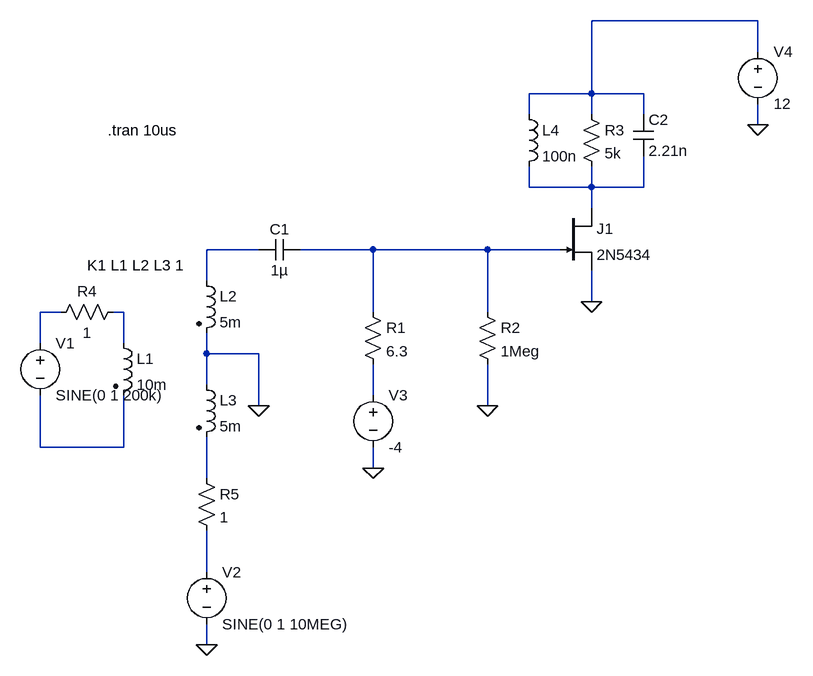
[diagram p0: schematic AMModulator.asc]
AMModulator.asc, the LTspice schematic file:
Version 4
SHEET 1 1160 680
WIRE 1104 -384 848 -384
WIRE 1104 -336 1104 -384
WIRE 848 -272 848 -384
WIRE 848 -272 752 -272
WIRE 928 -272 848 -272
WIRE 752 -240 752 -272
WIRE 848 -240 848 -272
WIRE 928 -240 928 -272
WIRE 1104 -224 1104 -256
WIRE 752 -128 752 -160
WIRE 848 -128 848 -160
WIRE 848 -128 752 -128
WIRE 928 -128 928 -176
WIRE 928 -128 848 -128
WIRE 848 -96 848 -128
WIRE 336 -32 256 -32
WIRE 512 -32 400 -32
WIRE 688 -32 512 -32
WIRE 800 -32 688 -32
WIRE 256 16 256 -32
WIRE 848 48 848 0
WIRE 32 64 0 64
WIRE 128 64 112 64
WIRE 512 64 512 -32
WIRE 688 64 688 -32
WIRE 0 112 0 64
WIRE 128 112 128 64
WIRE 256 128 256 96
WIRE 336 128 256 128
WIRE 256 176 256 128
WIRE 512 192 512 144
WIRE 336 208 336 128
WIRE 688 208 688 144
WIRE 0 272 0 192
WIRE 128 272 128 192
WIRE 128 272 0 272
WIRE 512 304 512 272
WIRE 256 320 256 256
WIRE 256 464 256 400
WIRE 256 576 256 544
FLAG 336 208 0
FLAG 256 576 0
FLAG 512 304 0
FLAG 848 48 0
FLAG 688 208 0
FLAG 1104 -224 0
SYMBOL voltage 0 96 R0
WINDOW 123 0 0 Left 0
WINDOW 39 0 0 Left 0
SYMATTR InstName V1
SYMATTR Value SINE(0 1 200k)
SYMBOL njf 800 -96 R0
SYMATTR InstName J1
SYMATTR Value 2N5434
SYMBOL ind2 112 96 R0
SYMATTR InstName L1
SYMATTR Value 10m
SYMBOL ind2 240 0 R0
SYMATTR InstName L2
SYMATTR Value 5m
SYMBOL ind2 240 160 R0
SYMATTR InstName L3
SYMATTR Value 5m
SYMBOL voltage 256 448 R0
WINDOW 123 0 0 Left 0
WINDOW 39 0 0 Left 0
SYMATTR InstName V2
SYMATTR Value SINE(0 1 10MEG)
SYMBOL cap 400 -48 R90
WINDOW 0 0 32 VBottom 2
WINDOW 3 32 32 VTop 2
SYMATTR InstName C1
SYMATTR Value 1µ
SYMBOL res 496 48 R0
SYMATTR InstName R1
SYMATTR Value 6.3
SYMBOL res 672 48 R0
SYMATTR InstName R2
SYMATTR Value 1Meg
SYMBOL voltage 512 176 R0
WINDOW 123 0 0 Left 0
WINDOW 39 0 0 Left 0
SYMATTR InstName V3
SYMATTR Value -4
SYMBOL res 832 -256 R0
SYMATTR InstName R3
SYMATTR Value 5k
SYMBOL cap 912 -240 R0
SYMATTR InstName C2
SYMATTR Value 2.21n
SYMBOL ind 736 -256 R0
SYMATTR InstName L4
SYMATTR Value 100n
SYMBOL voltage 1104 -352 R0
SYMATTR InstName V4
SYMATTR Value 12
SYMBOL res 128 48 R90
WINDOW 0 0 56 VBottom 2
WINDOW 3 32 56 VTop 2
SYMATTR InstName R4
SYMATTR Value 1
SYMBOL res 240 304 R0
SYMATTR InstName R5
SYMATTR Value 1
TEXT 72 -8 Left 2 !K1 L1 L2 L3 1
TEXT 104 -216 Left 2 !.tran 10us

The netlist it stands for:
* AMModulator.asc
V1 N005 N008 SINE(0 1 200k)
J1 N002 N004 0 2N5434
L1 N006 N008 10m
L2 N003 0 5m
L3 0 N009 5m
V2 N010 0 SINE(0 1 10MEG)
C1 N004 N003 1µ
R1 N004 N007 6.3
R2 N004 0 1Meg
V3 N007 0 -4
R3 N001 N002 5k
C2 N001 N002 2.21n
L4 N001 N002 100n
V4 N001 0 12
R4 N006 N005 1
R5 N009 N010 1
.model NJF NJF
.model PJF PJF
.lib standard.jft
K1 L1 L2 L3 1
.tran 10us
.backanno
.end